# EAGLE design MRCS_ANIMATION-CONTROLLER (EAGLE 7.7.0)
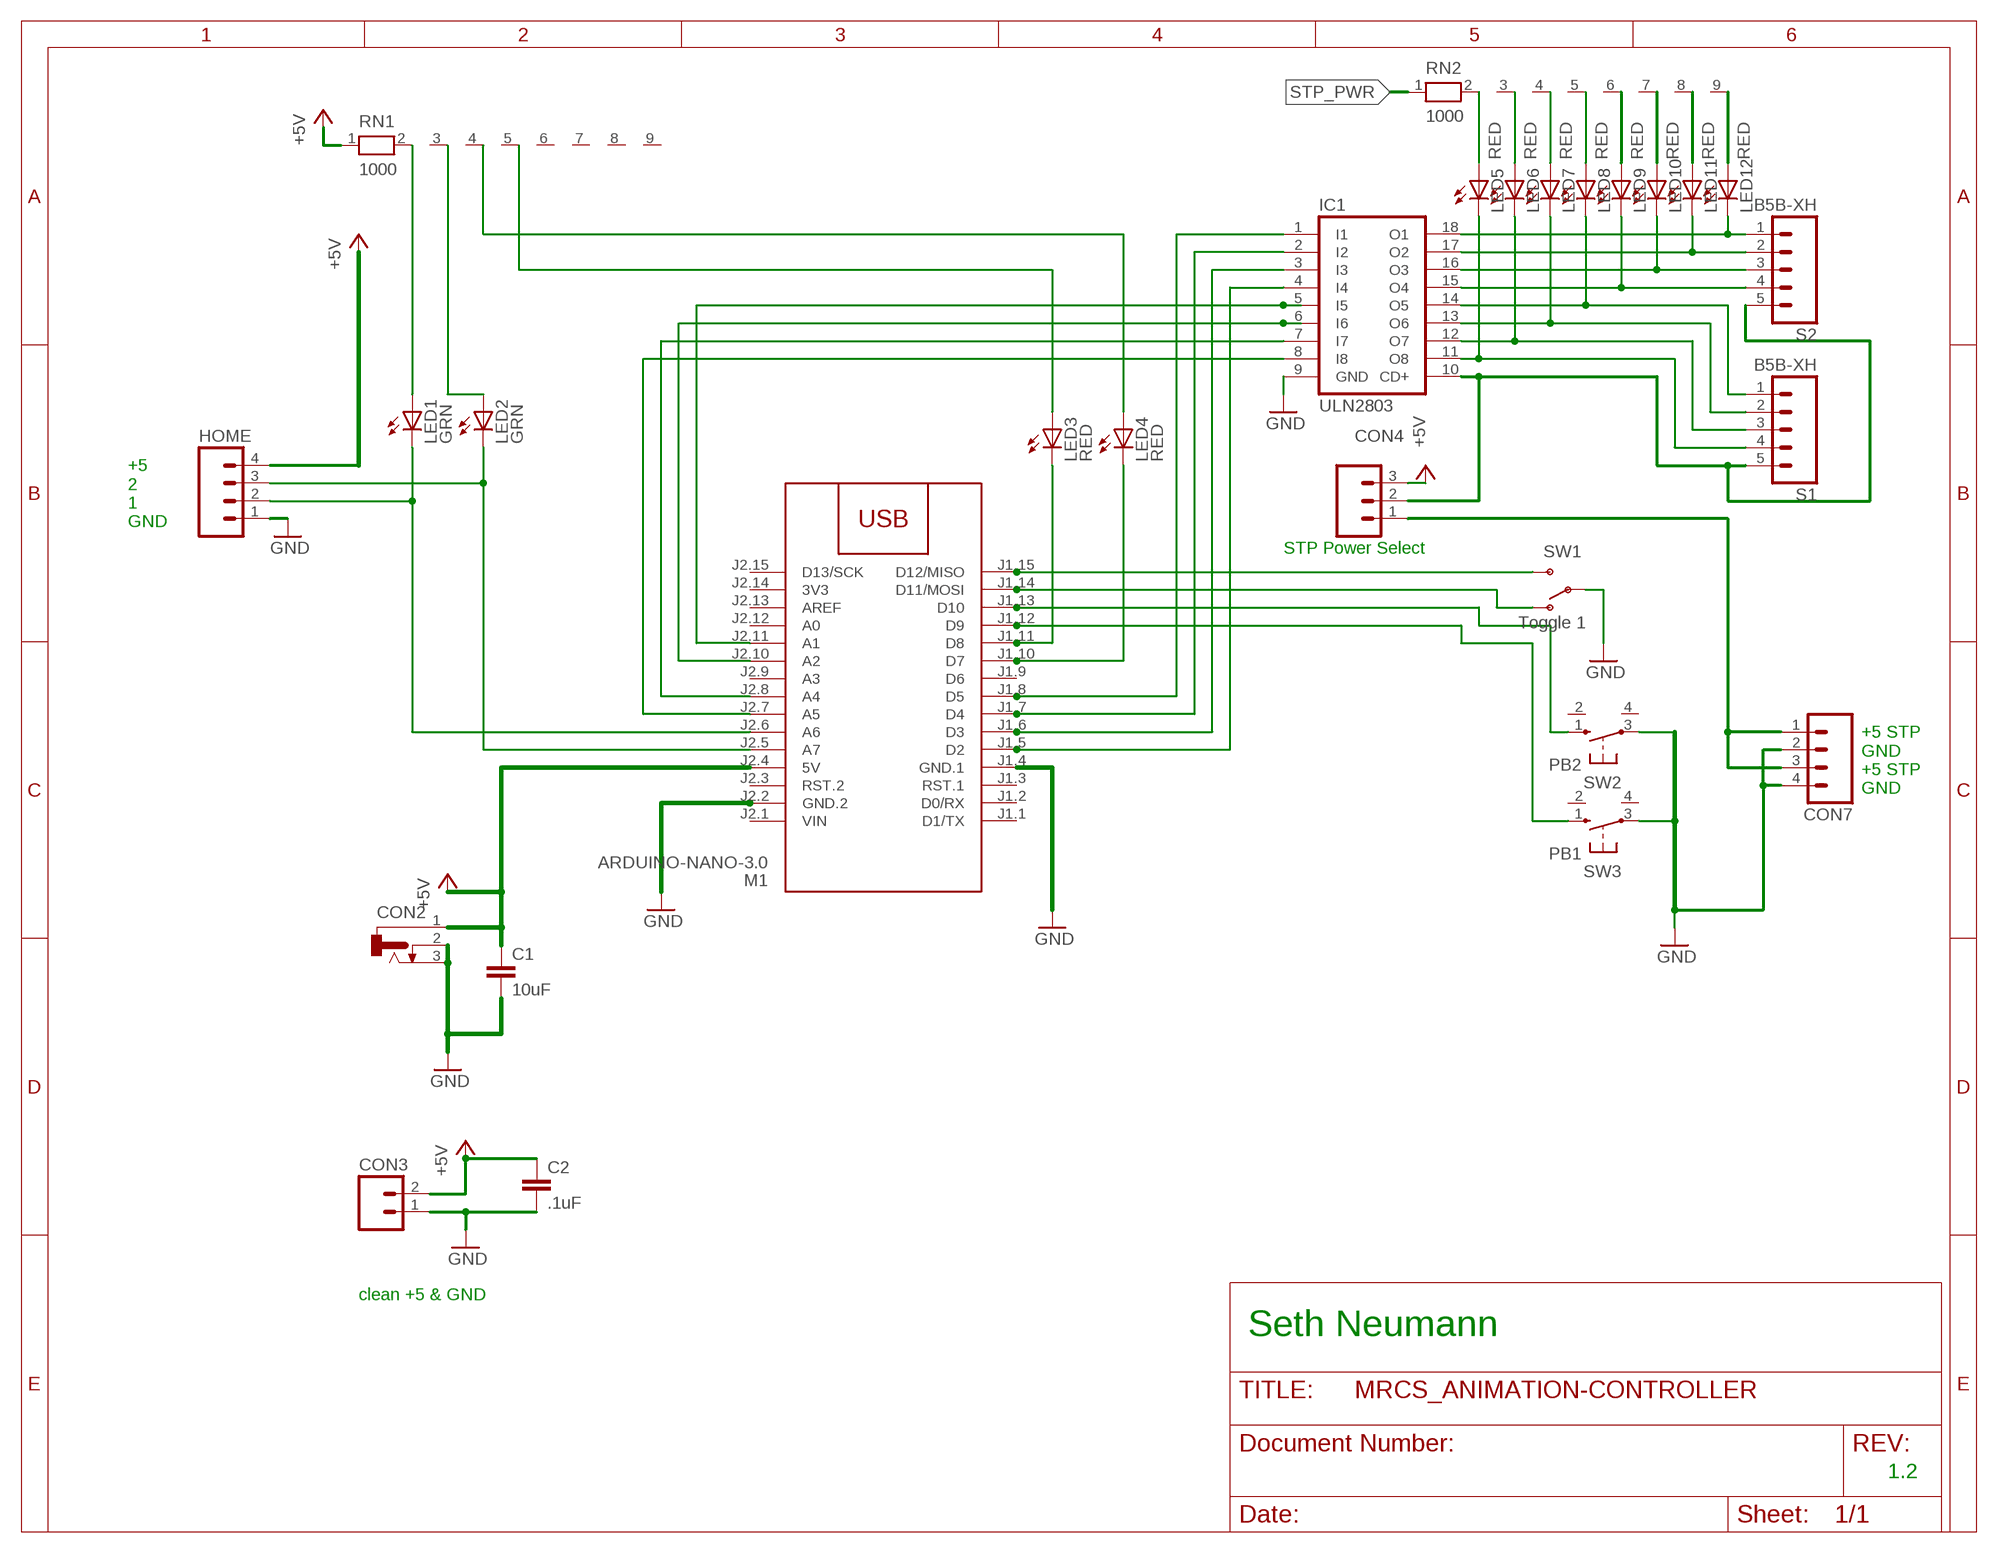
[diagram p0: schematic, sheet 1]

## Parts
C1  10uF  C5/3  [C5B3]
C2  .1uF  C5/3  [C5B3]
CON2  CONNECTOR-DC-POWER-RA  [DCJ0202]
CON3  CONNECTOR-M02350-LOCK  [1751248]
CON4  CONNECTOR-M03254-LOCK  [3POL254]
CON7  CONNECTOR-M04SCREW_LOCK  [SCREWTERMINAL-3.5MM-4_LOCK]
HOME  CONNECTOR-M04LOCK  [1X04_LOCK]
IC1  ULN2803  ULN2803A  [DIL18]
LED1  GRN  LEDLED3MM  [LED3MM]
LED2  GRN  LEDLED3MM  [LED3MM]
LED3  RED  LEDLED3MM  [LED3MM]
LED4  RED  LEDLED3MM  [LED3MM]
LED5  RED  LEDLED3MM  [LED3MM]
LED6  RED  LEDLED3MM  [LED3MM]
LED7  RED  LEDLED3MM  [LED3MM]
LED8  RED  LEDLED3MM  [LED3MM]
LED9  RED  LEDLED3MM  [LED3MM]
LED10  RED  LEDLED3MM  [LED3MM]
LED11  RED  LEDLED3MM  [LED3MM]
LED12  RED  LEDLED3MM  [LED3MM]
M1  ARDUINO-NANO-3.0  [ARDUINO-NANO-3.0]
RN1  1000  RN08  [RN-9]
RN2  1000  RN08  [RN-9]
S1  B5B-XH  CONNECTOR-M05LOCK  [1X05_LOCK]
S2  B5B-XH  CONNECTOR-M05LOCK  [1X05_LOCK]
SW1  Toggle 1  SWITCH-SPSTPTH-508  [SWITCH-SPDT-508]
SW2  PB2  SWITCH-(ON)SMALLPADS  [4P-PTH-6.0X6.0X5.0H]
SW3  PB1  SWITCH-(ON)SMALLPADS  [4P-PTH-6.0X6.0X5.0H]

## Nets
+5V: C1.1 C2.1 CON2.1 CON3.2(B) CON4.3 HOME.4 M1.J2.4(5V) RN1.1
GND: C1.2 C2.2 CON2.2 CON2.3 CON3.1(A) CON7.2 CON7.4 HOME.1 IC1.9(GND) M1.J1.4(GND.1) M1.J2.2(GND.2) SW1.2(P) SW2.3(P) SW3.3(P)
N$1: IC1.18(O1) LED12.K(C) S2.1
N$2: M1.J1.15(D12/MISO) SW1.3(S)
N$3: M1.J1.14(D11/MOSI) SW1.1(O)
N$4: M1.J1.13(D10) SW2.1(S)
N$5: M1.J1.12(D9) SW3.1(S)
N$6: LED3.K(C) M1.J1.11(D8)
N$7: LED4.K(C) M1.J1.10(D7)
N$8: LED3.A RN1.5
N$9: LED4.A RN1.4
N$10: LED2.A RN1.3
N$11: IC1.1(I1) M1.J1.8(D5)
N$12: IC1.2(I2) M1.J1.7(D4)
N$13: IC1.3(I3) M1.J1.6(D3)
N$14: IC1.4(I4) M1.J1.5(D2)
N$15: IC1.17(O2) LED11.K(C) S2.2
N$16: IC1.16(O3) LED10.K(C) S2.3
N$17: IC1.15(O4) LED9.K(C) S2.4
N$18: LED9.A RN2.6
N$19: HOME.3 LED2.K(C) M1.J2.5(A7)
N$20: LED10.A RN2.7
N$21: LED11.A RN2.8
N$22: LED12.A RN2.9
N$23: IC1.5(I5) M1.J2.11(A1)
N$24: IC1.6(I6) M1.J2.10(A2)
N$25: IC1.7(I7) M1.J2.8(A4)
N$26: IC1.8(I8) M1.J2.7(A5)
N$27: LED5.A RN2.2
N$28: CON4.1 CON7.1 CON7.3
N$29: HOME.2 LED1.K(C) M1.J2.6(A6)
N$30: LED1.A RN1.2
N$31: LED6.A RN2.3
N$32: IC1.14(O5) LED8.K(C) S1.1
N$33: IC1.13(O6) LED7.K(C) S1.2
N$34: IC1.12(O7) LED6.K(C) S1.3
N$35: IC1.11(O8) LED5.K(C) S1.4
N$36: LED7.A RN2.4
N$37: LED8.A RN2.5
STP_PWR: CON4.2 IC1.10(CD+) RN2.1 S1.5 S2.5
Unconnected: M1.J1.1(D1/TX) M1.J1.2(D0/RX) M1.J1.3(RST.1) M1.J1.9(D6) M1.J2.3(RST.2) M1.J2.9(A3) M1.J2.12(A0) M1.J2.13(AREF) M1.J2.15(D13/SCK) RN1.6 RN1.7 RN1.8 RN1.9 SW2.2(S1) SW2.4(P1) SW3.2(S1) SW3.4(P1)

## Notes on the sheet
- +5
  2
  1
  GND
- STP Power Select
- +5 STP
  GND
  +5 STP
  GND
- clean +5 & GND
- Seth Neumann
- 1.2

## Power pins joined to a net without a drawn wire
3V3: M1.J2.14(3V3)
VIN: M1.J2.1(VIN)

## Library data of the parts
C1 C2 = capacitor-wima:C: CAPACITOR naming: grid - package width
CON2 = SPCoast:CONNECTOR-DC-POWER: DC POWER JACK
CON3 = SPCoast:CONNECTOR-M02: PHOENIX CONNECTOR
CON4 = SPCoast:CONNECTOR-M03
CON7 HOME = SPCoast:CONNECTOR-M04: Header 4 Standard 4-pin 0.1" header. Use with straight break away headers (SKU : PRT-00116), right angle break away headers (PRT-00553), swiss pins (PRT-00743), machine pins (PRT-00117), and female headers (PRT-00115). Molex polarized connector foot print use with SKU : PRT-08231 with associated crimp pins and housings. 1MM SMD Version SKU: PRT-10208
IC1 = uln-udn:ULN2803A: DRIVER ARRAY
LED1-LED12 = SPCoast:LED*
M1 = diy-modules:ARDUINO-NANO-3.0: Arduino Nano 3.0 and compatible devices More details available here: https://www.arduino.cc/en/Main/ArduinoBoardNano Click here to find device on ebay.com <http://www.ebay.com/sch/arduino+nano>
RN1 RN2 = resistor-net:RN08: RESISTOR NETWORK; OC_FARNELL: unknown; OC_NEWARK: unknown
S1 S2 = SPCoast:CONNECTOR-M05: Header 5 Standard 5-pin 0.1" header. Use with straight break away headers (SKU : PRT-00116), right angle break away headers (PRT-00553), swiss pins (PRT-00743), machine pins (PRT-00117), and female headers (PRT-00115). Molex polarized connector foot print use with SKU : PRT-08230 with associated crimp pins and housings.
SW1 = SPCoast:SWITCH-SPST: SPST Switch Simple slide switch. Spark Fun Electronics SKU : COM-00102
SW2 SW3 = SPCoast:SWITCH-(ON): OMRON SWITCH; BEST: TS-1109; OMRON: B3F-10XX; OPL: 3110040P1

## Board
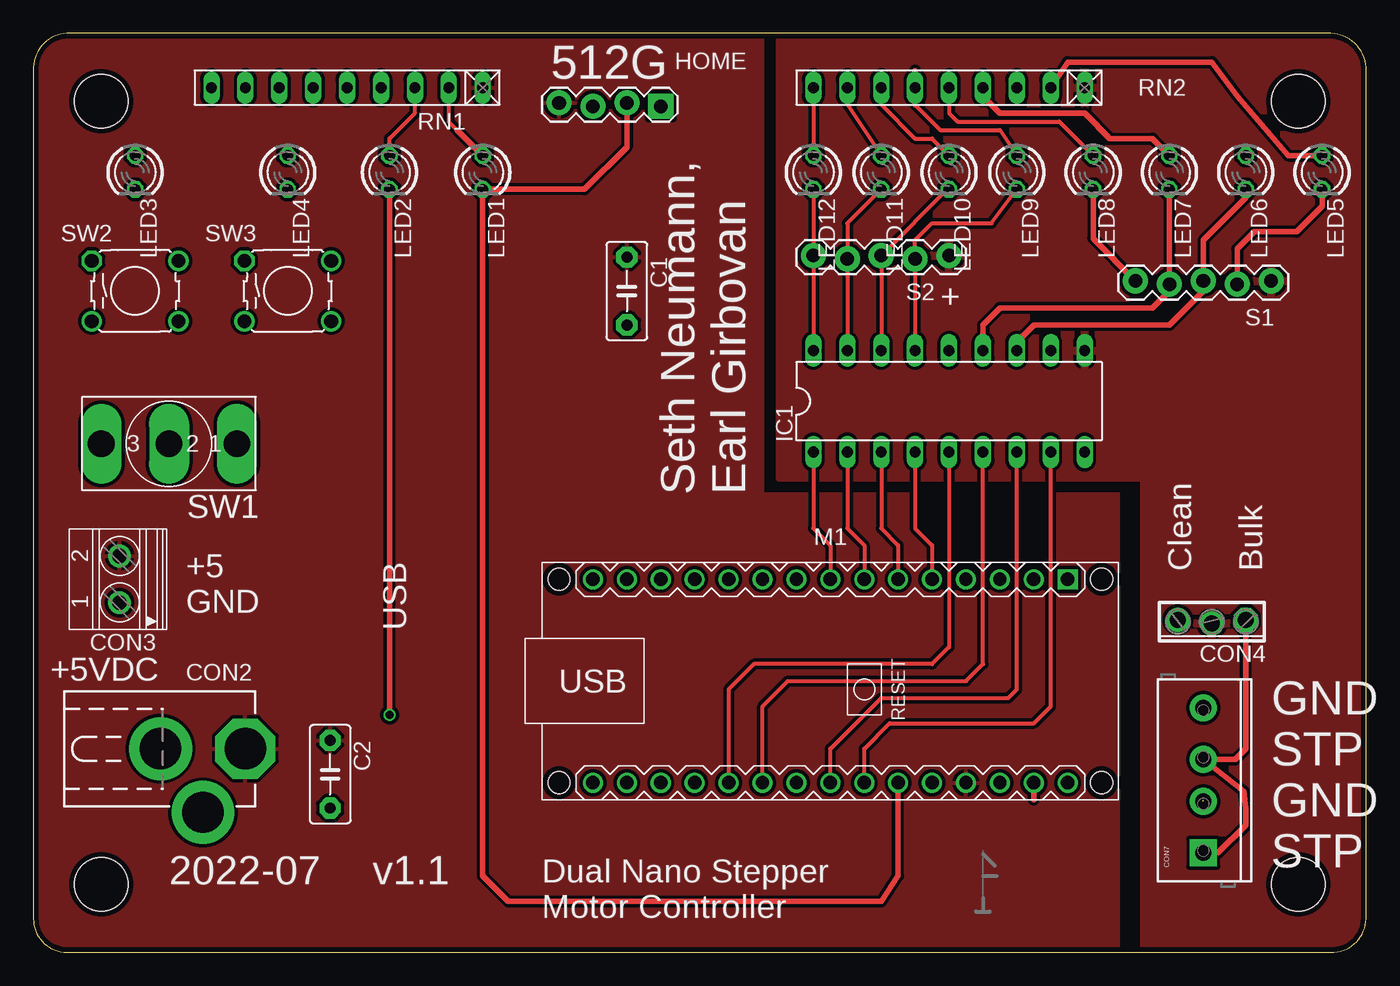
[diagram p1: board, top side]
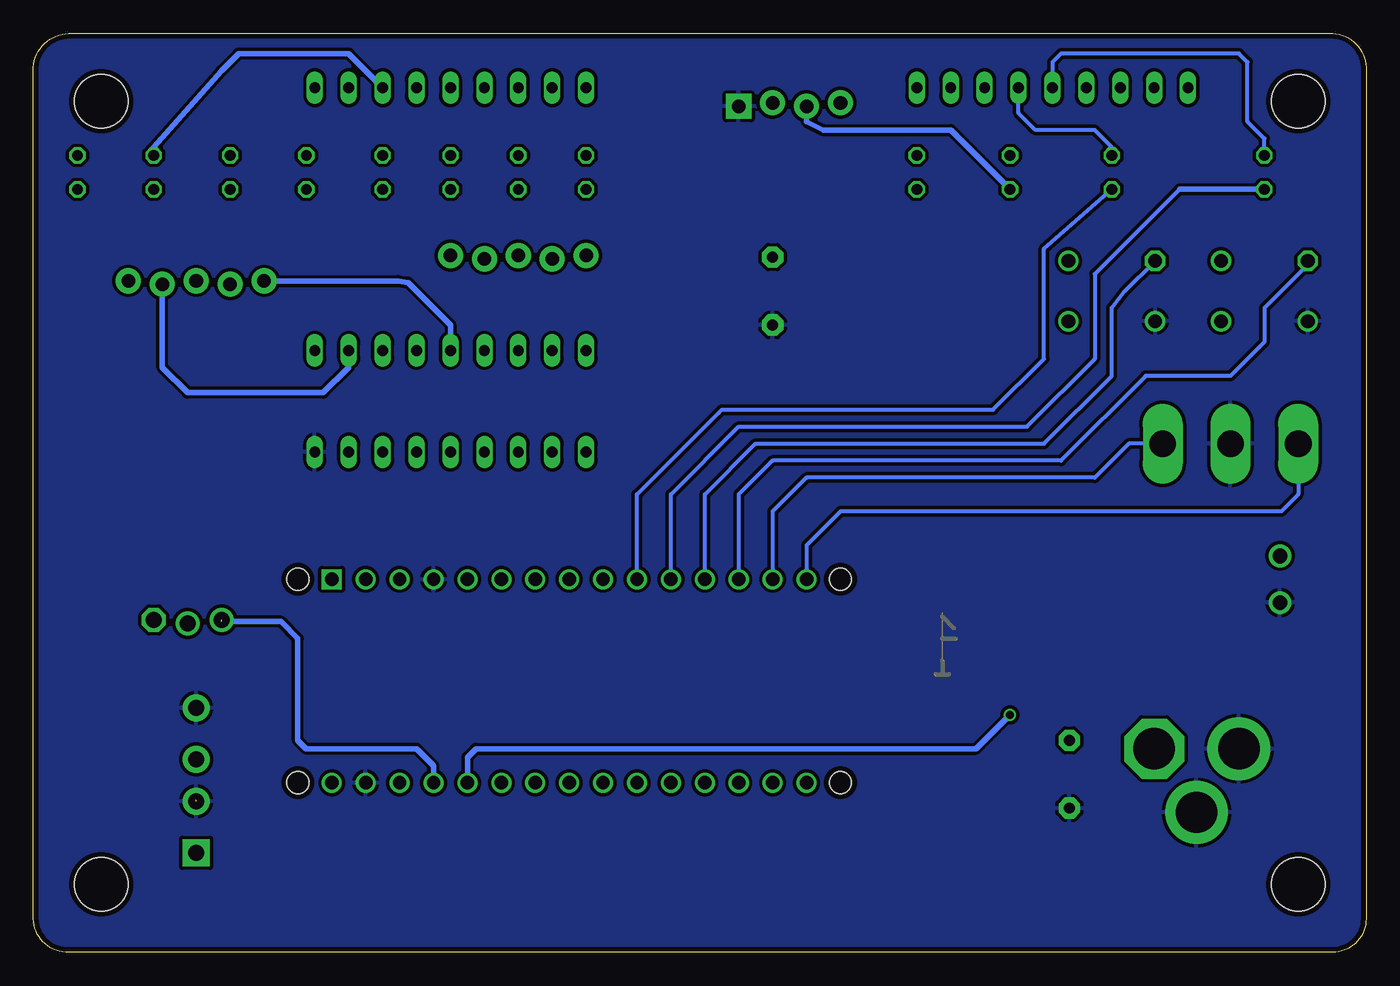
[diagram p2: board, bottom side, seen from below]

Size 99.82 x 68.83 mm. Coordinates in mm from the lower left corner, seen from the top.
Copper layers (1*16): Top 0.035mm / dielectric 1.5mm / Bottom 0.035mm
Design rules "default *": minimum track width 5mil, minimum drill 0.2mm, track to track 5mil, track to pad 5mil, pad to pad 5mil, via to via 5mil, smd to smd 5mil, copper to edge 0.4mm, drill to drill 5mil, minimum pad ring 3mil, minimum via ring 3mil, stop-mask expansion 4mil, vias tented up to drill 0mil, thermal gap 10mil

### Footprints (pad centres in the part's own frame; a part is rotated, then mirrored left to right if it is on the bottom)
C5B3 = drill 0.813 pad 1.6 octagon: 1 -2.54,0; 2 2.54,0
DCJ0202 = drill 3.1 pad 4.5 octagon: 1 0,3.175 | drill 3.1 pad 4.7: 2 4.763,0; 3 0,-3.175
1751248 = drill 1.1 pad 1.7: 1 -1.75,-0.1; 2 1.75,-0.1
3POL254 = drill 1.2 octagon: 1 -2.54,-0.127 | drill 1.2: 2 0,0.127; 3 2.54,-0.127
SCREWTERMINAL-3.5MM-4_LOCK = drill 1.2 pad 2.032 square: 1 -0.178,0 | drill 1.2 pad 2.032: 2 3.678,0; 3 6.822,0; 4 10.678,0
1X04_LOCK = drill 1.016 pad 1.88 square: 1 0,0.127 | drill 1.016 pad 1.88: 2 2.54,-0.127; 3 5.08,0.127; 4 7.62,-0.127
DIL18 = drill 0.813 long: 1 -10.16,-3.81; 2 -7.62,-3.81; 3 -5.08,-3.81; 4 -2.54,-3.81; 5 0,-3.81; 6 2.54,-3.81; 7 5.08,-3.81; 8 7.62,-3.81; 9 10.16,-3.81; 10 10.16,3.81; 11 7.62,3.81; 12 5.08,3.81; 13 2.54,3.81; 14 0,3.81; 15 -2.54,3.81; 16 -5.08,3.81; 17 -7.62,3.81; 18 -10.16,3.81
LED3MM = drill 0.813 octagon: A 1.27,0; K -1.27,0
ARDUINO-NANO-3.0 = drill 1 square: J1.1 17.78,7.62 | drill 1: J1.2 15.24,7.62; J1.3 12.7,7.62; J1.4 10.16,7.62; J1.5 7.62,7.62; J1.6 5.08,7.62; J1.7 2.54,7.62; J1.8 0,7.62; J1.9 -2.54,7.62; J1.10 -5.08,7.62; J1.11 -7.62,7.62; J1.12 -10.16,7.62; J1.13 -12.7,7.62; J1.14 -15.24,7.62; J1.15 -17.78,7.62; J2.1 17.78,-7.62; J2.2 15.24,-7.62; J2.3 12.7,-7.62; J2.4 10.16,-7.62; J2.5 7.62,-7.62; J2.6 5.08,-7.62; J2.7 2.54,-7.62; J2.8 0,-7.62; J2.9 -2.54,-7.62; J2.10 -5.08,-7.62; J2.11 -7.62,-7.62; J2.12 -10.16,-7.62; J2.13 -12.7,-7.62; J2.14 -15.24,-7.62; J2.15 -17.78,-7.62 | hole 1.651: -20.32,7.62; -20.32,-7.62; 20.32,-7.62; 20.32,7.62
RN-9 = drill 0.813 long: 1 -10.16,0; 2 -7.62,0; 3 -5.08,0; 4 -2.54,0; 5 0,0; 6 2.54,0; 7 5.08,0; 8 7.62,0; 9 10.16,0
1X05_LOCK = drill 1.016 pad 1.88: 1 0,0.127; 2 2.54,-0.127; 3 5.08,0.127; 4 7.62,-0.127; 5 10.16,0.127
SWITCH-SPDT-508 = drill 2 long: 1 -5.08,0; 2 0,0; 3 5.08,0
4P-PTH-6.0X6.0X5.0H = drill 1.016 octagon: 1 -3.251,2.261 | drill 1.016: 2 3.251,2.261; 3 -3.251,-2.261; 4 3.251,-2.261
BOARD-DINRAIL-2.71IN-MRCS = hole 4: 94.742,5.08; 5.08,63.754; 94.742,63.754; 5.08,5.08

### Placement (x,y rotation side)
C1  44.45,49.53 270 top
C2  22.23,13.34 270 top
CON2  12.7,15.24 270 top
CON3  6.35,27.94 90 top
CON4  88.27,24.77 180 top
CON7  87.63,7.62 90 top
HOME  46.99,63.5 180 top
IC1  68.58,41.27 0 top
LED1  33.66,58.42 90 top
LED2  26.67,58.42 90 top
LED3  7.62,58.42 90 top
LED4  19.05,58.42 90 top
LED5  96.52,58.42 90 top
LED6  90.81,58.42 90 top
LED7  85.09,58.42 90 top
LED8  79.38,58.42 90 top
LED9  73.66,58.42 90 top
LED10  68.58,58.42 90 top
LED11  63.5,58.42 90 top
LED12  58.42,58.42 90 top
M1  59.69,20.32 0 top
RN1  23.5,64.77 180 top
RN2  68.58,64.77 180 top
S1  82.55,50.16 0 top
S2  58.42,52.07 0 top
SW1  10.16,38.1 180 top
SW2  7.62,49.53 0 top
SW3  19.05,49.53 0 top
U$1  [BOARD-DINRAIL-2.71IN-MRCS]  0,0 0 top
U$2  [CA-PROP65WARNING]  71.12,24.13 0 top
U$3  [MRCSLOGOTOP]  69.85,2.54 0 top
U$4  [MRCSLOGOBTM]  25.4,20.32 0 top

### Tracks (layer width: path | path; a pad name or v marks a point on that pad's centre or on a via)
+5V  (1 unrouted)
  Bottom 0.406: M1.J2.4 69.85,13.97 71.12,15.24 79.38,15.24 80.01,15.88 80.01,23.5 81.28,24.77 85.73,24.77
  pour Top (isolate 0.254): 0,0 81.28,0 81.28,34.29 54.61,34.29 54.61,68.58 0,68.58
GND  (1 unrouted)
  Top 0.406: M1.J2.2 74.93,11.43 | 87,10.79 87.63,11.43
  pour Bottom (isolate 0.254): 0,0 100.33,0 100.33,68.58 0,68.58
N$1
  Top 0.305: LED12.K S2.1 IC1.18
N$2
  Bottom 0.305: SW1.3 5.08,34.29 6.35,33.02 39.37,33.02 41.91,30.48 M1.J1.15
N$3
  Bottom 0.305: SW1.1 17.78,38.1 20.32,35.56 41.91,35.56 44.45,33.02 M1.J1.14
N$4
  Bottom 0.305: SW2.1 4.37,51.51 7.62,48.26 7.62,45.72 10.16,43.18 16.51,43.18 22.86,36.83 44.45,36.83 46.99,34.29 M1.J1.13
N$5
  Bottom 0.305: M1.J1.12 49.53,34.29 45.72,38.1 24.13,38.1 19.05,43.18 19.05,48.26 18.06,49.53 SW3.1
N$6
  Bottom 0.305: M1.J1.11 52.07,34.29 46.99,39.37 25.4,39.37 20.32,44.45 20.32,50.8 13.97,57.15
  Bottom 0.406: 13.97,57.15 LED3.K
N$7
  Bottom 0.305: M1.J1.10 54.61,34.29 48.26,40.64 27.94,40.64 24.13,44.45 24.13,52.7 LED4.K
N$8
  Bottom 0.305: LED3.A 7.62,60.96 8.89,62.23 8.89,66.67 9.53,67.31 22.86,67.31 23.5,66.67 RN1.5
N$9
  Bottom 0.305: LED4.A 19.05,60.33 20.32,61.59 24.77,61.59 26.04,62.87 RN1.4
N$10
  Top 0.305: LED2.A 26.67,60.96 28.58,62.87 RN1.3
N$11
  Top 0.305: IC1.1 58.42,31.75 59.69,30.48 M1.J1.8
N$12
  Top 0.305: IC1.2 60.96,31.75 62.23,30.48 M1.J1.7
N$13
  Top 0.305: IC1.3 63.5,31.75 64.77,30.48 M1.J1.6
N$14
  Top 0.305: IC1.4 66.04,31.75 67.31,30.48 M1.J1.5
N$15
  Top 0.305: LED11.K 60.96,54.61 S2.2 IC1.17
N$16
  Top 0.305: LED10.K 68.46,57.15 S2.3 IC1.16
N$17
  Top 0.305: LED9.K 71.76,54.61 67.31,54.61 66.04,53.34 S2.4 IC1.15
N$18
  Top 0.305: RN2.6 66.04,66.04 | 66.04,63.5 67.95,61.59 72.39,61.59 LED9.A
  Top 0.406: 66.04,66.04 66.04,63.5
N$19  (via drill 0.6)
  Top 0.406: v26.67,17.78 LED2.K
  Bottom 0.406: HOME.3 41.91,62.23 40.64,61.59 31.12,61.59 LED2.K | M1.J2.5 67.31,14.61 66.68,15.24 29.21,15.24 v26.67,17.78
N$20
  Top 0.305: RN2.7 63.5,63.5 66.04,60.96 67.31,60.96 LED10.A
N$21
  Top 0.305: RN2.8 60.96,63.5 LED11.A
N$22
  Top 0.305: RN2.9 LED12.A
N$23
  Top 0.305: IC1.5 68.58,22.86 67.31,21.59 53.98,21.59 52.07,19.68 M1.J2.11 52.07,12.06
N$24
  Top 0.305: M1.J2.10 54.61,18.41 56.52,20.32 69.85,20.32 71.12,21.59 IC1.6
N$25
  Top 0.305: M1.J2.8 59.69,15.24 63.5,19.05 73.03,19.05 73.66,19.68 IC1.7
N$26
  Top 0.305: M1.J2.7 62.23,15.24 64.14,17.14 74.93,17.14 76.2,18.41 IC1.8
N$27
  Top 0.406: RN2.2 77.47,66.67 88.27,66.67 90.17,64.14 93.98,59.69 LED5.A
N$28
  Top 0.406: CON7.1 88.72,7.44 90.81,9.53 90.81,10.79 90.64,12.06 CON7.3 90.01,14.44 90.81,15.24 CON4.1
N$29
  Top 0.406: HOME.2 44.45,60.33 41.28,57.15 LED1.K 33.66,5.71 35.56,3.81 63.5,3.81 64.77,5.71 M1.J2.6
N$30
  Top 0.305: RN1.2 31.12,62.23 31.75,61.59
  Top 0.406: 31.75,61.59 LED1.A
N$31
  Bottom 0.406: RN2.3 76.2,67.31 84.46,67.31 85.73,66.04 90.81,60.33 LED6.A
N$32
  Top 0.406: LED8.K 79.38,53.47 S1.1
  Bottom 0.406: S1.1 72.52,50.29 71.76,50.16 68.58,46.99 IC1.14
N$33
  Top 0.406: LED7.K S1.2 85.09,49.53 83.82,48.26 72.39,48.26 71.12,46.99 IC1.13
N$34
  Top 0.406: LED6.K 90.81,56.52 87.63,53.34 S1.3 87.63,49.53 85.09,46.99 74.93,46.99 73.66,45.72 IC1.12
N$35
  Top 0.406: LED5.K 96.52,55.88 94.62,53.98 91.44,53.98 90.17,52.7 S1.4
  Bottom 0.406: IC1.11 76.2,43.81 78.11,41.91 88.27,41.91 90.17,43.81 S1.4
N$36
  Top 0.406: RN2.4 71.12,64.14 72.39,62.87 78.74,62.87 80.65,60.96 83.82,60.96 LED7.A
N$37
  Top 0.305: RN2.5 68.58,62.87 69.22,62.23 76.84,62.23 LED8.A
STP_PWR
  pour Top (isolate 0.254): 83.19,0 100.33,0 100.33,67.31 99.06,68.58 55.88,68.58 55.88,35.56 83.19,35.56

### Text on the board
tPlace: 512G | + | Seth Neumann, / Earl Girbovan | Clean / / Bulk | +5 / GND | USB | +5VDC | GND / STP / GND / STP | 2022-07 | v1.1 | Dual Nano Stepper / Motor Controller